# Altium schematic sheet top_level.SchDoc
size A4; SheetNumber: 1; SheetTotal: 11
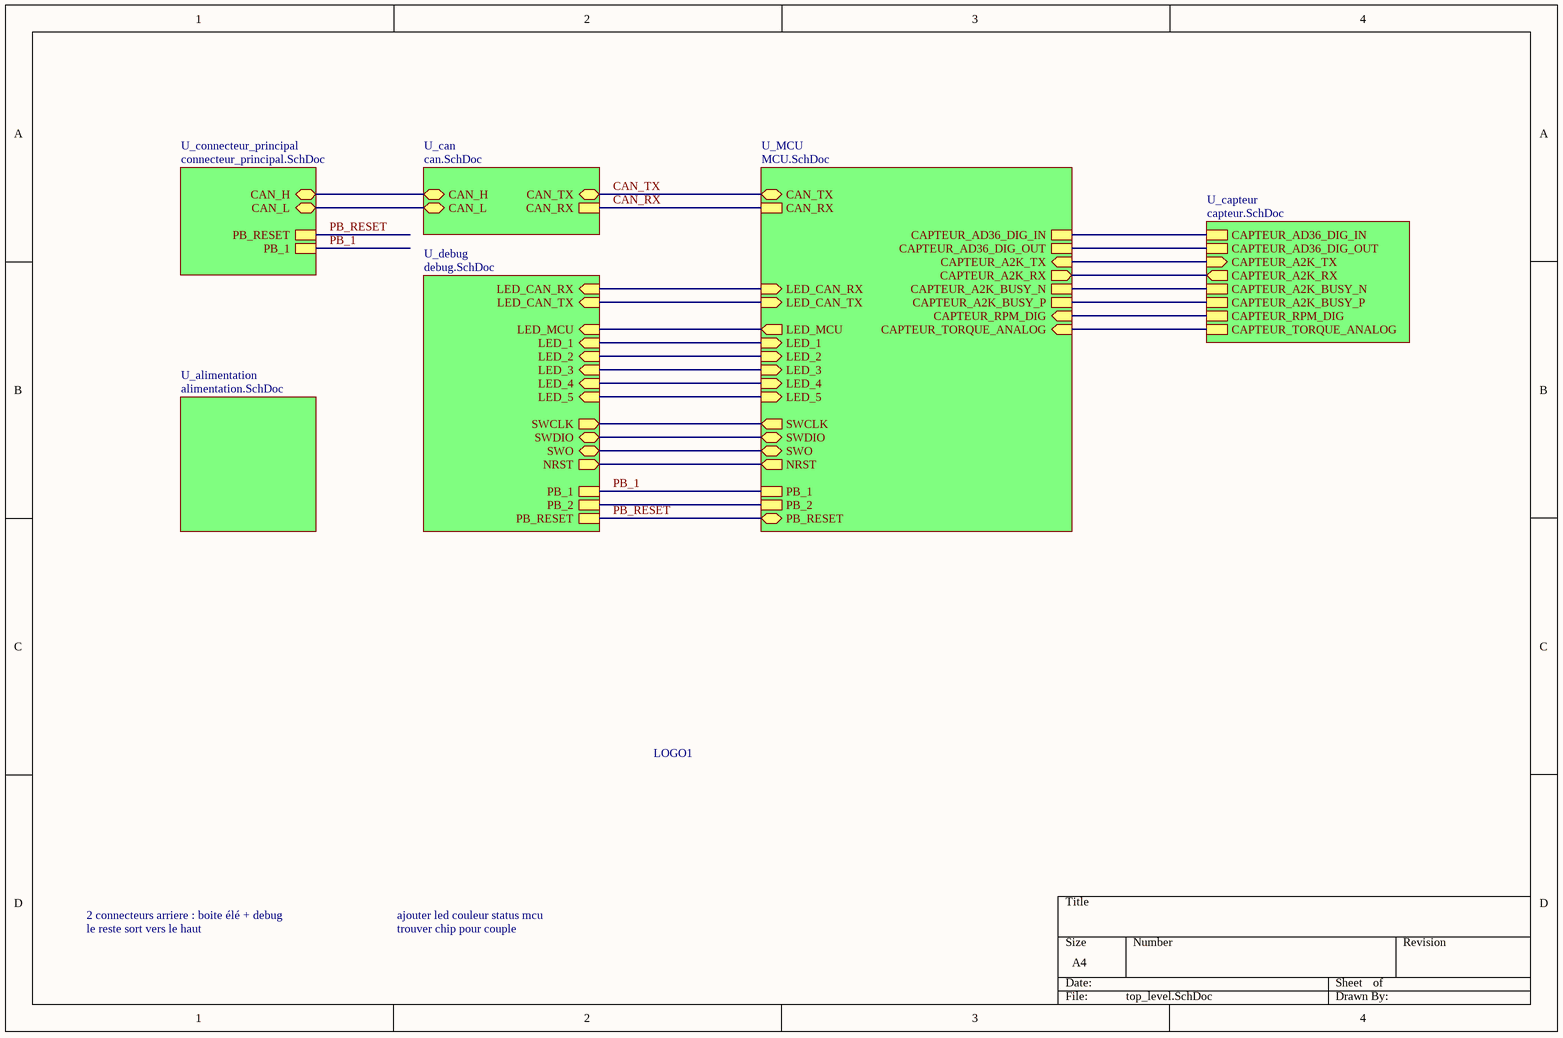
[diagram p0: top_level.SchDoc]

## Parts
LOGO1  VOTRE NOM DE LOGO  [LOGO-CHINOOK]  (value not drawn)

## Sub-sheets
U_alimentation = alimentation.SchDoc: no entries
U_can = can.SchDoc: CAN_H (bidir), CAN_L (bidir), CAN_TX (bidir), CAN_RX
U_capteur = capteur.SchDoc: CAPTEUR_AD36_DIG_IN, CAPTEUR_AD36_DIG_OUT, CAPTEUR_A2K_TX (in), CAPTEUR_A2K_RX (out), CAPTEUR_A2K_BUSY_N, CAPTEUR_A2K_BUSY_P, CAPTEUR_RPM_DIG, CAPTEUR_TORQUE_ANALOG
U_connecteur_principal = connecteur_principal.SchDoc: CAN_H (bidir), CAN_L (bidir), PB_1, PB_RESET
U_debug = debug.SchDoc: LED_CAN_RX (in), LED_CAN_TX (in), SWCLK (out), SWDIO (bidir), SWO (bidir), NRST (out), LED_1 (in), LED_MCU (in), LED_2 (in), LED_3 (in), LED_4 (in), LED_5 (in), PB_1, PB_2, PB_RESET
U_MCU = MCU.SchDoc: SWCLK (out), SWDIO (bidir), SWO (bidir), NRST (out), CAPTEUR_AD36_DIG_IN, CAPTEUR_AD36_DIG_OUT, CAPTEUR_A2K_TX (in), CAPTEUR_A2K_RX (out), CAPTEUR_A2K_BUSY_N, CAPTEUR_A2K_BUSY_P, LED_CAN_RX (in), LED_CAN_TX (in), LED_1 (in), LED_2 (in), LED_3 (in), LED_4 (in), LED_5 (in), PB_1, CAPTEUR_TORQUE_ANALOG (in), CAN_RX, LED_MCU (out), PB_RESET (bidir), PB_2, CAPTEUR_RPM_DIG (in), CAN_TX (bidir)

## Nets
CAN_RX: sheet U_MCU/CAN_RX, sheet U_can/CAN_RX
CAN_TX: sheet U_MCU/CAN_TX, sheet U_can/CAN_TX
PB_1: sheet U_MCU/PB_1, sheet U_debug/PB_1, sheet U_connecteur_principal/PB_1
PB_RESET: sheet U_MCU/PB_RESET, sheet U_debug/PB_RESET, sheet U_connecteur_principal/PB_RESET
(unnamed): sheet U_MCU/SWCLK, sheet U_debug/SWCLK
(unnamed): sheet U_MCU/SWDIO, sheet U_debug/SWDIO
(unnamed): sheet U_MCU/SWO, sheet U_debug/SWO
(unnamed): sheet U_MCU/NRST, sheet U_debug/NRST
(unnamed): sheet U_MCU/CAPTEUR_AD36_DIG_IN, sheet U_capteur/CAPTEUR_AD36_DIG_IN
(unnamed): sheet U_MCU/CAPTEUR_AD36_DIG_OUT, sheet U_capteur/CAPTEUR_AD36_DIG_OUT
(unnamed): sheet U_MCU/CAPTEUR_A2K_TX, sheet U_capteur/CAPTEUR_A2K_TX
(unnamed): sheet U_MCU/CAPTEUR_A2K_RX, sheet U_capteur/CAPTEUR_A2K_RX
(unnamed): sheet U_MCU/CAPTEUR_A2K_BUSY_N, sheet U_capteur/CAPTEUR_A2K_BUSY_N
(unnamed): sheet U_MCU/CAPTEUR_A2K_BUSY_P, sheet U_capteur/CAPTEUR_A2K_BUSY_P
(unnamed): sheet U_MCU/LED_CAN_RX, sheet U_debug/LED_CAN_RX
(unnamed): sheet U_MCU/LED_CAN_TX, sheet U_debug/LED_CAN_TX
(unnamed): sheet U_MCU/LED_1, sheet U_debug/LED_1
(unnamed): sheet U_MCU/LED_2, sheet U_debug/LED_2
(unnamed): sheet U_MCU/LED_3, sheet U_debug/LED_3
(unnamed): sheet U_MCU/LED_4, sheet U_debug/LED_4
(unnamed): sheet U_MCU/LED_5, sheet U_debug/LED_5
(unnamed): sheet U_MCU/CAPTEUR_TORQUE_ANALOG, sheet U_capteur/CAPTEUR_TORQUE_ANALOG
(unnamed): sheet U_MCU/LED_MCU, sheet U_debug/LED_MCU
(unnamed): sheet U_MCU/PB_2, sheet U_debug/PB_2
(unnamed): sheet U_MCU/CAPTEUR_RPM_DIG, sheet U_capteur/CAPTEUR_RPM_DIG
(unnamed): sheet U_can/CAN_H, sheet U_connecteur_principal/CAN_H
(unnamed): sheet U_can/CAN_L, sheet U_connecteur_principal/CAN_L

## Notes on the sheet
- 2 connecteurs arriere : boite élé + debug
- ajouter led couleur status mcu
- le reste sort vers le haut
- trouver chip pour couple

## Library data of the parts
LOGO1 = LOGO - FOOTPRINT